# Altium schematic sheet schematic.SchDoc
size A4; SheetNumber: 1; SheetTotal: 1
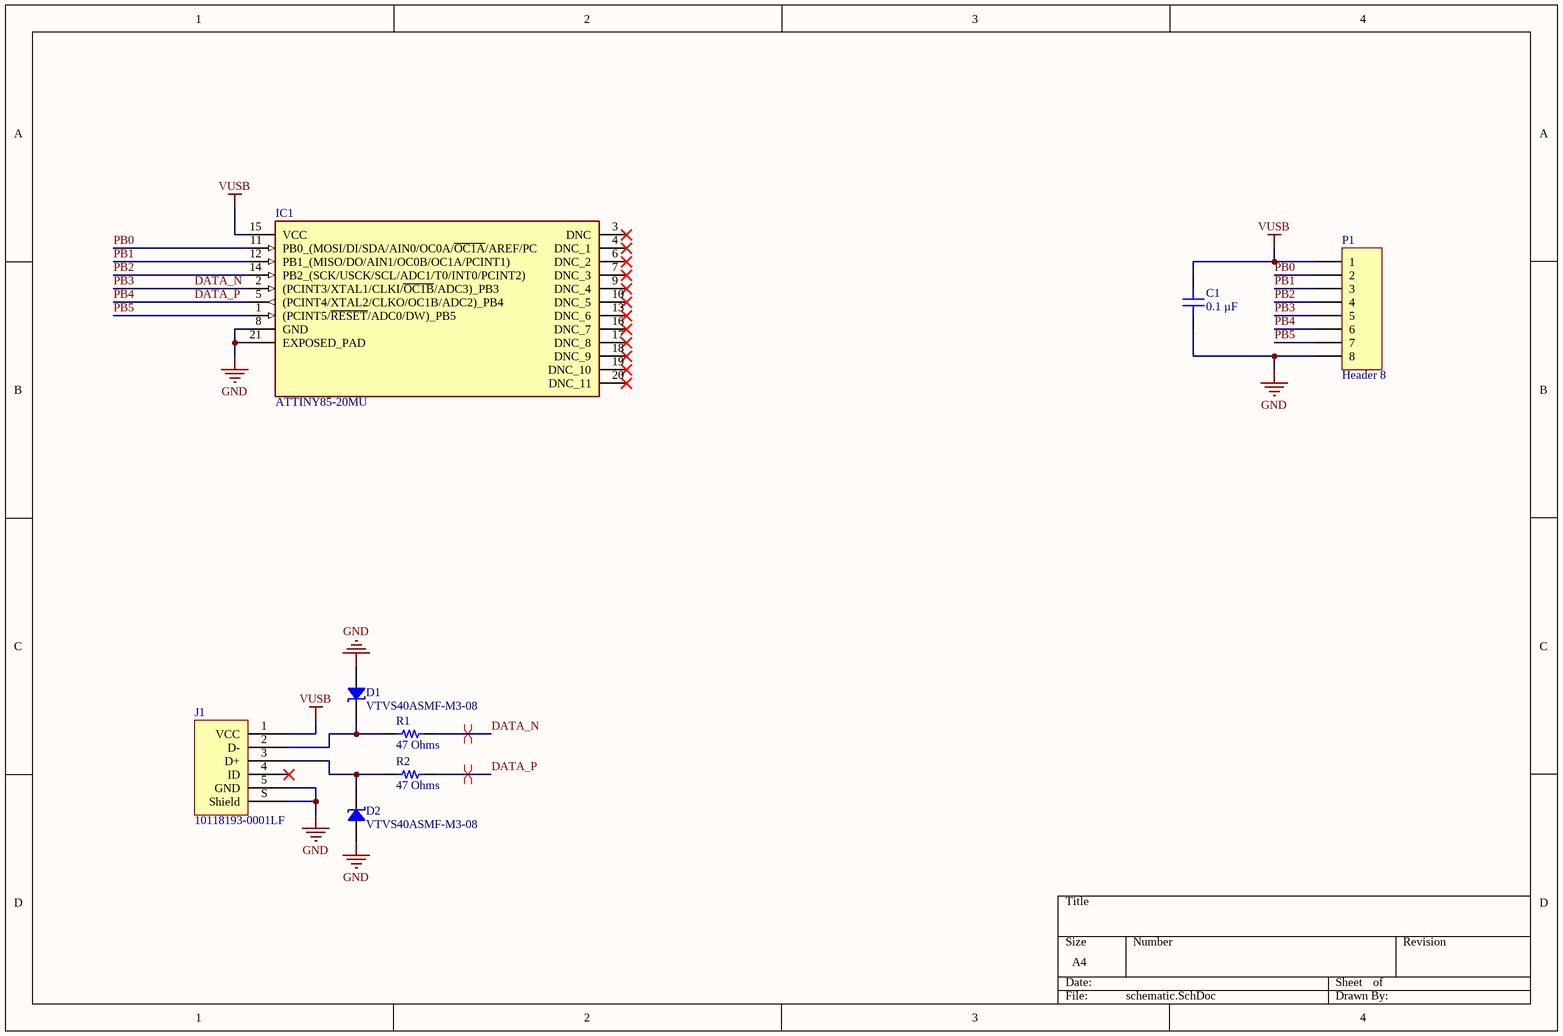
[diagram p0: schematic.SchDoc]

## Parts
C1  0.1 µF  [CAP 0402_1005]
D1  VTVS40ASMF-M3-08  [SMF DO-219AB]
D2  VTVS40ASMF-M3-08  [SMF DO-219AB]
IC1  ATTINY85-20MU  [QFN50P400X400X80-21N-D]
J1  10118193-0001LF  [FCI USB 10118193-0001LF]
P1  Header 8  [HDR1X8]
R1  47 Ohms  [RES 0402_1005]
R2  47 Ohms  [RES 0402_1005]

## Nets
GND: C1.1 D1.1 D2.1 IC1.8(GND) IC1.21(EXPOSED_PAD) J1.5(GND) J1.S(Shield) P1.8
VUSB: C1.2 IC1.15(VCC) J1.1(VCC) P1.1
DATA_N: IC1.2((PCINT3/XTAL1/CLKI/~{OC1B}/ADC3)_PB3) P1.5 R1.2  [also labelled PB3]
DATA_P: IC1.5((PCINT4/XTAL2/CLKO/OC1B/ADC2)_PB4) P1.6 R2.2  [also labelled PB4]
PB0: IC1.11(PB0_(MOSI/DI/SDA/AIN0/OC0A/~{OC1A}/AREF/PC) P1.2
PB1: IC1.12(PB1_(MISO/DO/AIN1/OC0B/OC1A/PCINT1)) P1.3
PB2: IC1.14(PB2_(SCK/USCK/SCL/ADC1/T0/INT0/PCINT2)) P1.4
PB5: IC1.1((PCINT5/~{RESET}/ADC0/DW)_PB5) P1.7
NetD1_2: D1.2 J1.2(D-) R1.1
NetD2_2: D2.2 J1.3(D+) R2.1

Not connected (* = marked no-connect by the designer): IC1 3(DNC)* 4(DNC_1)* 6(DNC_2)* 7(DNC_3)* 9(DNC_4)* 10(DNC_5)* 13(DNC_6)* 16(DNC_7)* 17(DNC_8)* 18(DNC_9)* 19(DNC_10)* 20(DNC_11)*; J1 4(ID)*

## Layout directives
differential pair: DATA_N, DATA_P

## Library data of the parts
C1 = TMK105BJ104KVHF: CAP CER 0.1UF 25V X5R 0402; Part Number: TMK105BJ104KVHF; Value: 0.1 µF
D1 D2 = VTVS40ASMF-M3-08: TVS DIODE 39.6V 67V DO219AB; Part Number: VTVS40ASMF-M3-08
IC1 = ATTINY85-20MU: Integrated Circuit; Manufacturer_Name: Microchip; Datasheet Link: http://www.atmel.com/Images/Atmel-2586-AVR-8-bit-Microcontroller-ATtiny25-ATtiny45-ATtiny85_Datasheet.pdf; Height: 0.8mm; Manufacturer_Part_Number: ATTINY85-20MU; Mouser Part Number: 556-ATTINY85-20MU; Mouser Price/Stock: https://www.mouser.co.uk/ProductDetail/Microchip-Technology-Atmel/ATTINY85-20MU?qs=8jWQYweyg6PrfFUt16UN%252Bg%3D%3D; Arrow Part Number: ATTINY85-20MU; Arrow Price/Stock: https://www.arrow.com/en/products/attiny85-20mu/microchip-technology?region=nac; Description: ATTINY85-20MU
J1 = 10118193-0001LF: CONN RCPT USB2.0 MICRO B SMD R/A; Part Number: 10118193-0001LF
P1 = Header 8: Header, 8-Pin; LatestRevisionDate: 17-Jul-2002; LatestRevisionNote: Re-released for DXP Platform.; Publisher: Altium Limited
R1 R2 = RMCF0402FT47R0: RES 47 OHM 1% 1/16W 0402; Part Number: RMCF0402FT47R0; Value: 47 Ohms